# Altium schematic sheet control.SchDoc: Control
size A4; Organization: GPA Robotics; Revision: REV 0
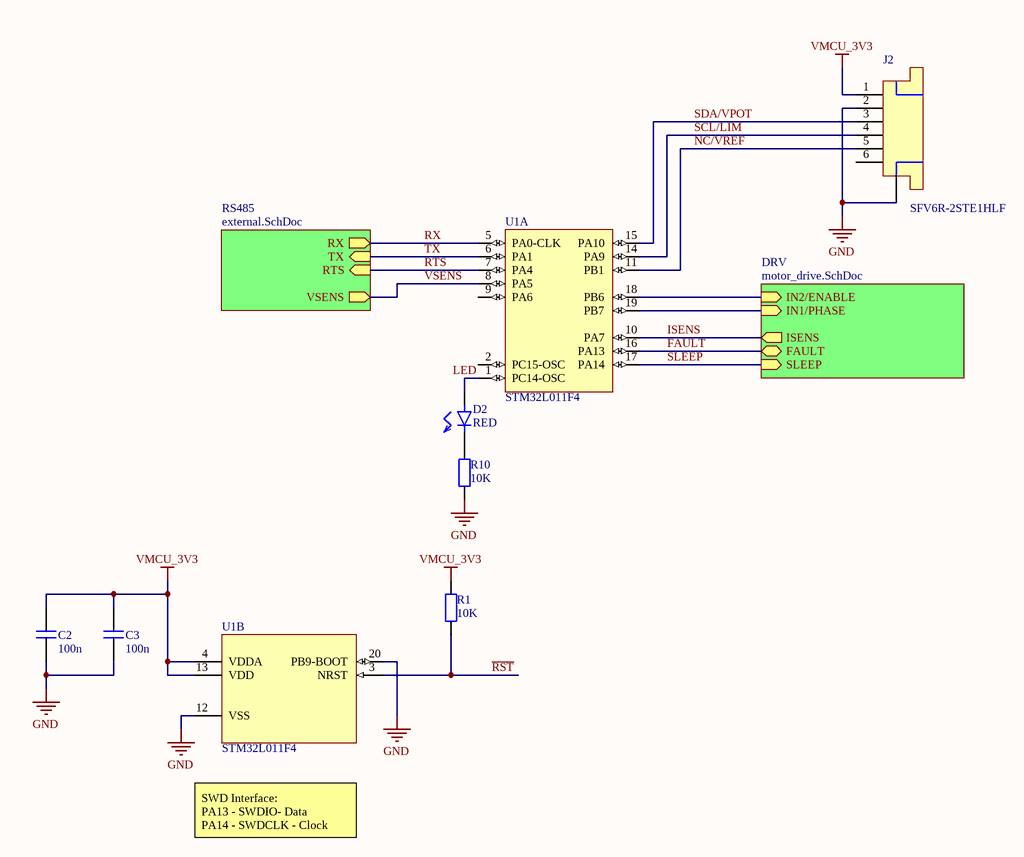
[diagram p0: control.SchDoc]

## Parts
C2  value 100n  [CAPC1005X06N]  (hidden comment: cap)
C3  value 100n  [CAPC1005X06N]  (hidden comment: cap)
D2  value RED  [CAPCP1005X06N]  (hidden comment: led)
J2  SFV6R-2STE1HLF  [SFV6R-2STE1HLF]
R1  value 10K  [RESC1005X04N]  (hidden comment: res)
R10  value 10K  [RESC1005X04N]  (hidden comment: res)
U1  STM32L011F4  [QFN50P300X300X60-20N]  (parts A,B of 2)

## Sub-sheets
DRV = motor_drive.SchDoc: IN2/ENABLE (in), IN1/PHASE (in), ISENS (out), FAULT (bidir), SLEEP (in)
RS485 = external.SchDoc: RX (out), RTS (in), TX (in), VSENS (out)

## Nets
GND: C2.1 C3.1 J2.2 J2.ANCHOR R10.1 U1.12(VSS) U1.20(PB9-BOOT)
VMCU_3V3: C2.2 C3.2 J2.1 R1.2 U1.4(VDDA) U1.13(VDD)
~{RST}: R1.1 U1.3(NRST)
FAULT: U1.16(PA13) ; sheet DRV/FAULT
ISENS: U1.10(PA7) ; sheet DRV/ISENS
LED: D2.A U1.1(PC14-OSC)
NC/VREF: J2.5 U1.11(PB1)
RTS: U1.7(PA4) ; sheet RS485/RTS
RX: U1.5(PA0-CLK) ; sheet RS485/RX
SCL/LIM: J2.4 U1.14(PA9)
SDA/VPOT: J2.3 U1.15(PA10)
SLEEP: U1.17(PA14) ; sheet DRV/SLEEP
TX: U1.6(PA1) ; sheet RS485/TX
VSENS: U1.8(PA5) ; sheet RS485/VSENS
NetD2_C: D2.C R10.2
NetU1_18: U1.18(PB6) ; sheet DRV/IN2/ENABLE
NetU1_19: U1.19(PB7) ; sheet DRV/IN1/PHASE

Not connected (* = marked no-connect by the designer): J2 6; U1 2(PC15-OSC) 9(PA6)

## Notes on the sheet
- SWD Interface:
  PA13 - SWDIO- Data
  PA14 - SWDCLK - Clock
- Title
- Size:
- Date:
- A4
- Number:
- Time:
- Revision:
- Sheet
- of
- Repo:

## Library data of the parts
C2 C3 = cap: Capacitor; voltage: *; type: *; #digikey: *; #mouser: *
D2 = led: pin to pad: A>1 C>2
J2 = sfv6r-2ste1hlf: 6 Position FFC, FPC Connector Contacts, Top 0.020" (0.50mm) Surface Mount, Right Angle; ComponentLink1Description: Datasheet; ComponentLink1URL: https://cdn.amphenol-icc.com/media/wysiwyg/files/drawing/10112793.pdf; #digikey: *; #mouser: *
R1 R10 = res: Resistor; power: *; voltage: *; #digikey: *; #mouser: *
U1 = stm32l011f4u